# Altium schematic sheet TOP_Level_Sheet_TopBoard.SchDoc
size A
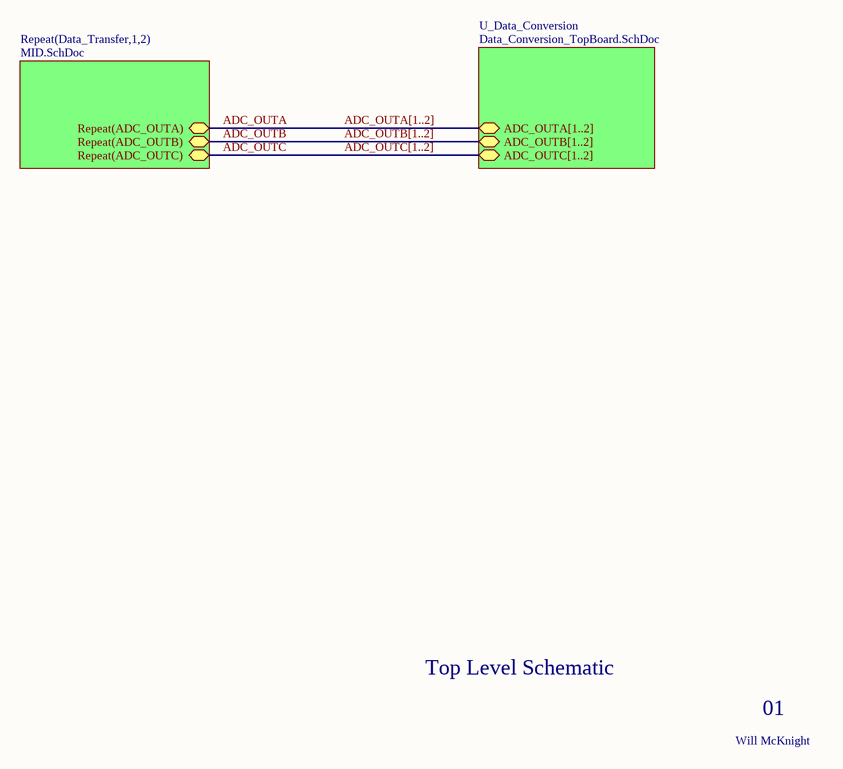
[diagram p0: TOP_Level_Sheet_TopBoard.SchDoc]

## Sub-sheets
Repeat(Data_Transfer,1,2) = MID.SchDoc: Repeat(ADC_OUTA) (bidir), Repeat(ADC_OUTB) (bidir), Repeat(ADC_OUTC) (bidir)
U_Data_Conversion = Data_Conversion_TopBoard.SchDoc: ADC_OUTA[1..2] (bidir), ADC_OUTB[1..2] (bidir), ADC_OUTC[1..2] (bidir)

## Nets
ADC_OUTA: sheet Repeat(Data_Transfer,1,2)/Repeat(ADC_OUTA)
ADC_OUTB: sheet Repeat(Data_Transfer,1,2)/Repeat(ADC_OUTB)
ADC_OUTC: sheet Repeat(Data_Transfer,1,2)/Repeat(ADC_OUTC)

## Buses and harness runs
bus ADC_OUTA[1..2] = sheet U_Data_Conversion/ADC_OUTA[1..2]
bus ADC_OUTB[1..2] = sheet U_Data_Conversion/ADC_OUTB[1..2]
bus ADC_OUTC[1..2] = sheet U_Data_Conversion/ADC_OUTC[1..2]

## Notes on the sheet
- Top Level Schematic
- 01
- Will McKnight